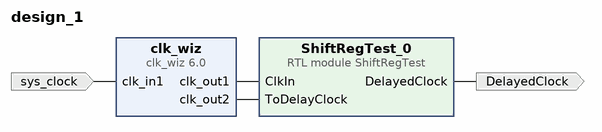
[diagram p0: block diagram of the top level]
# Vivado block design design_1, xc7z020clg400-1, Vivado 2023.1
create_bd_design design_1

create_bd_port -dir I -type clk sys_clock
set_property -dict {CONFIG.FREQ_HZ 125000000 CONFIG.PHASE 0.0} [get_bd_ports sys_clock]
create_bd_port -dir O DelayedClock

create_bd_cell -type module -reference ShiftRegTest ShiftRegTest_0
create_bd_cell -type ip -vlnv xilinx.com:ip:clk_wiz:6.0 clk_wiz
set_property -dict [list \
  CONFIG.CLKOUT1_JITTER 157.673 \
  CONFIG.CLKOUT1_PHASE_ERROR 122.096 \
  CONFIG.CLKOUT1_REQUESTED_OUT_FREQ 50.000 \
  CONFIG.CLKOUT2_JITTER 249.501 \
  CONFIG.CLKOUT2_PHASE_ERROR 122.096 \
  CONFIG.CLKOUT2_REQUESTED_OUT_FREQ 5.000 \
  CONFIG.CLKOUT2_USED true \
  CONFIG.CLK_IN1_BOARD_INTERFACE sys_clock \
  CONFIG.MMCM_CLKFBOUT_MULT_F 5.000 \
  CONFIG.MMCM_CLKIN2_PERIOD 10.0 \
  CONFIG.MMCM_CLKOUT0_DIVIDE_F 12.500 \
  CONFIG.MMCM_CLKOUT1_DIVIDE 125 \
  CONFIG.NUM_OUT_CLKS 2 \
  CONFIG.USE_BOARD_FLOW true \
] [get_bd_cells clk_wiz]

# ---- connections ----

connect_bd_net [get_bd_pins ShiftRegTest_0/DelayedClock] [get_bd_ports DelayedClock]
connect_bd_net [get_bd_pins clk_wiz/clk_out1] [get_bd_pins ShiftRegTest_0/ClkIn]
connect_bd_net [get_bd_pins clk_wiz/clk_out2] [get_bd_pins ShiftRegTest_0/ToDelayClock]
connect_bd_net [get_bd_ports sys_clock] [get_bd_pins clk_wiz/clk_in1]

validate_bd_design
save_bd_design
